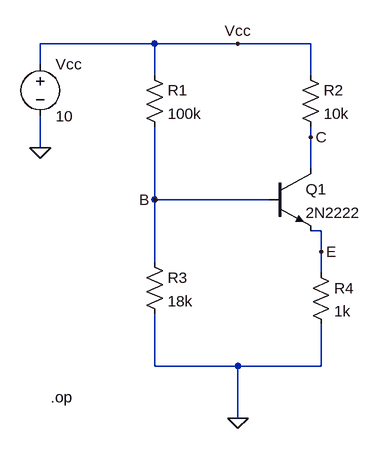
[diagram p0: schematic biasing_the_transistor.asc]
biasing_the_transistor.asc, the LTspice schematic file:
Version 4
SHEET 1 904 1172
WIRE 192 80 16 80
WIRE 320 80 192 80
WIRE 432 80 320 80
WIRE 16 112 16 80
WIRE 192 128 192 80
WIRE 432 128 432 80
WIRE 432 224 432 208
WIRE 16 240 16 192
WIRE 432 272 432 224
WIRE 192 320 192 208
WIRE 368 320 192 320
WIRE 448 368 432 368
WIRE 448 400 448 368
WIRE 192 416 192 320
WIRE 448 432 448 400
WIRE 192 576 192 496
WIRE 320 576 192 576
WIRE 448 576 448 512
WIRE 448 576 320 576
WIRE 320 656 320 576
FLAG 320 656 0
FLAG 16 240 0
FLAG 192 320 B
FLAG 432 224 C
FLAG 448 400 E
FLAG 320 80 Vcc
SYMBOL res 176 112 R0
SYMATTR InstName R1
SYMATTR Value 100k
SYMBOL res 416 112 R0
SYMATTR InstName R2
SYMATTR Value 10k
SYMBOL res 176 400 R0
SYMATTR InstName R3
SYMATTR Value 18k
SYMBOL res 432 416 R0
SYMATTR InstName R4
SYMATTR Value 1k
SYMBOL npn 368 272 R0
SYMATTR InstName Q1
SYMATTR Value 2N2222
SYMBOL voltage 16 96 R0
SYMATTR InstName Vcc
SYMATTR Value 10
TEXT 32 624 Left 2 !.op

The netlist it stands for:
* biasing_the_transistor.asc
R1 Vcc B 100k
R2 Vcc C 10k
R3 B 0 18k
R4 E 0 1k
Q1 C B E 0 2N2222
Vcc Vcc 0 10
.model NPN NPN
.model PNP PNP
.lib standard.bjt
.op
.backanno
.end